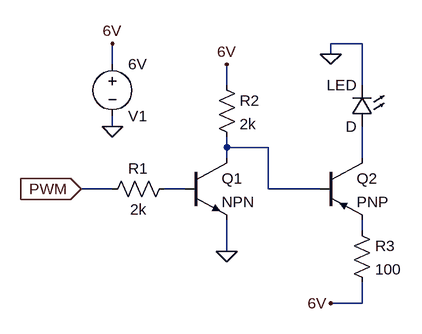
[diagram p0: schematic pwm-circuit.asc]
pwm-circuit.asc, the LTspice schematic file:
Version 4
SHEET 1 880 680
WIRE 528 -64 480 -64
WIRE 480 -48 480 -64
WIRE 144 -32 144 -64
WIRE 320 0 320 -32
WIRE 528 0 528 -64
WIRE 144 64 144 48
WIRE 320 96 320 80
WIRE 384 96 320 96
WIRE 320 112 320 96
WIRE 528 112 528 64
WIRE 144 160 96 160
WIRE 256 160 224 160
WIRE 384 160 384 96
WIRE 464 160 384 160
WIRE 528 224 528 208
WIRE 320 256 320 208
WIRE 528 336 528 304
WIRE 528 336 480 336
FLAG 96 160 PWM
IOPIN 96 160 In
FLAG 320 256 0
FLAG 144 64 0
FLAG 144 -64 6V
FLAG 320 -32 6V
FLAG 480 336 6V
FLAG 480 -48 0
SYMBOL res 240 144 R90
WINDOW 0 0 56 VBottom 2
WINDOW 3 32 56 VTop 2
SYMATTR InstName R1
SYMATTR Value 2k
SYMBOL npn 256 112 R0
SYMATTR InstName Q1
SYMBOL res 304 -16 R0
SYMATTR InstName R2
SYMATTR Value 2k
SYMBOL voltage 144 -48 R0
WINDOW 0 24 96 Left 2
WINDOW 3 24 16 Left 2
WINDOW 123 0 0 Left 2
WINDOW 39 0 0 Left 2
SYMATTR InstName V1
SYMATTR Value 6V
SYMBOL pnp 464 112 R0
SYMATTR InstName Q2
SYMBOL res 512 208 R0
SYMATTR InstName R3
SYMATTR Value 100
SYMBOL LED 544 64 R180
WINDOW 0 24 64 Left 2
WINDOW 3 24 0 Left 2
SYMATTR InstName LED

The netlist it stands for:
* pwm-circuit.asc
R1 N003 PWM 2k
Q1 N001 N003 0 0 NPN
R2 6V N001 2k
V1 6V 0 6V
Q2 N002 N001 N004 0 PNP
R3 N004 6V 100
D§LED N002 0 D
.model D D
.lib standard.dio
.model NPN NPN
.model PNP PNP
.lib standard.bjt
.backanno
.end